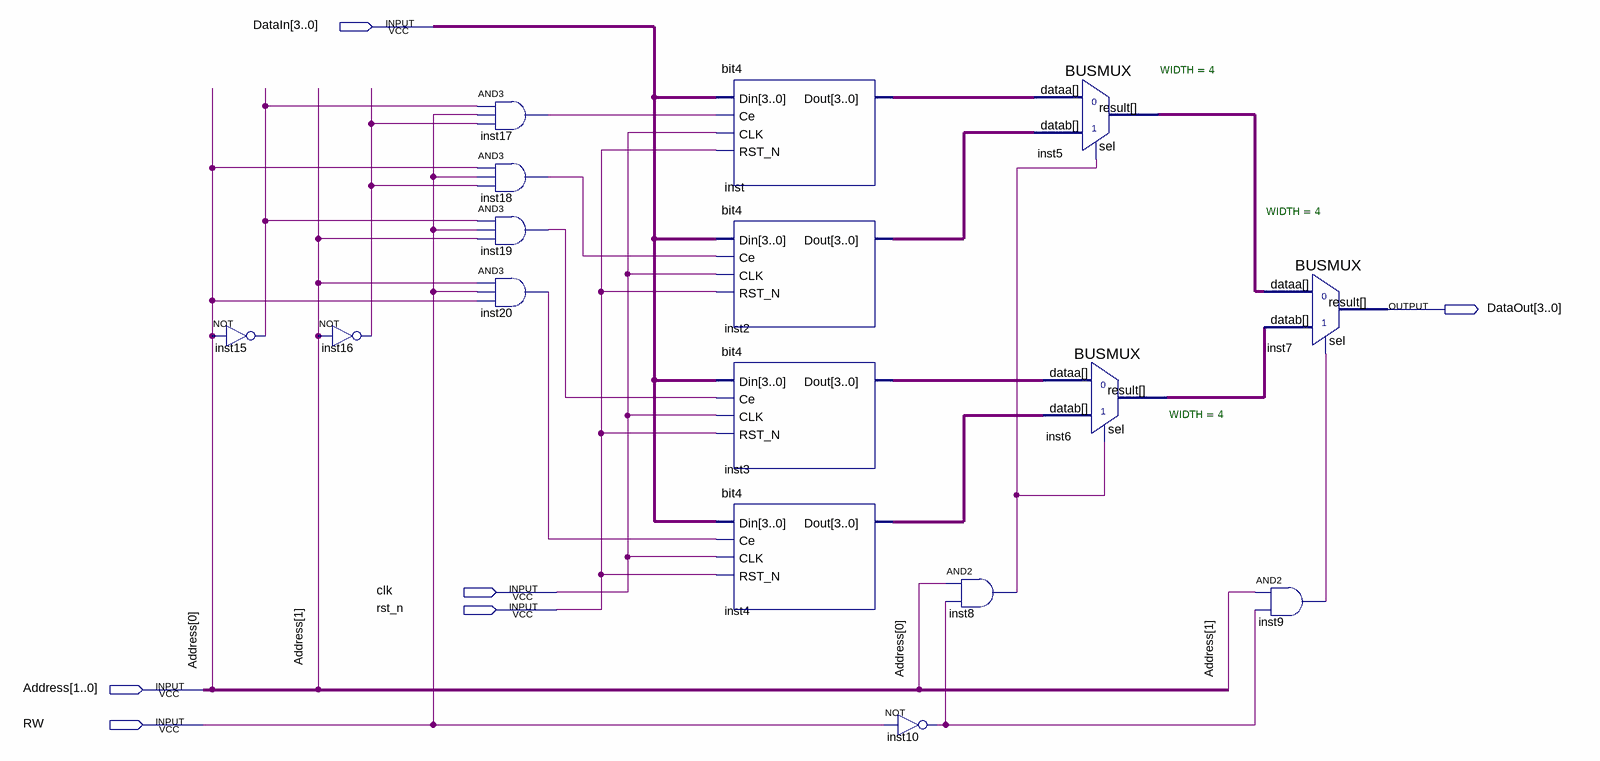
[diagram p0: schematic sheet]
// Quartus schematic chap5_1_chae.bdf as structural Verilog: 16 symbols, 6 pins
module chap5_1_chae (
  input  [3:0] DataIn,
  input  clk,
  input  rst_n,
  input  [1:0] Address,
  input  RW,
  output [3:0] DataOut
);

  wire inst8_out, inst9_out, inst10_out, inst15_out, inst16_out, inst17_out, inst18_out, inst19_out,
       inst20_out;
  wire [3:0] inst2_dout, inst3_dout, inst4_dout, inst5_result, inst6_result, inst_dout;

  not inst15 (inst15_out, Address[0]);
  not inst16 (inst16_out, Address[1]);
  and inst17 (inst17_out, inst15_out, RW, inst16_out);
  and inst18 (inst18_out, Address[0], RW, inst16_out);
  and inst19 (inst19_out, inst15_out, RW, Address[1]);
  and inst20 (inst20_out, Address[1], RW, Address[0]);
  bit4 inst (.Din(DataIn), .Ce(inst17_out), .CLK(clk), .RST_N(rst_n), .Dout(inst_dout));
  bit4 inst2 (.Din(DataIn), .Ce(inst18_out), .CLK(clk), .RST_N(rst_n), .Dout(inst2_dout));
  bit4 inst3 (.Din(DataIn), .Ce(inst19_out), .CLK(clk), .RST_N(rst_n), .Dout(inst3_dout));
  bit4 inst4 (.Din(DataIn), .Ce(inst20_out), .CLK(clk), .RST_N(rst_n), .Dout(inst4_dout));
  not inst10 (inst10_out, RW);
  and inst8 (inst8_out, Address[0], inst10_out);
  BUSMUX #(.WIDTH(4)) inst5 (.datab(inst2_dout), .sel(inst8_out), .dataa(inst_dout), .result(inst5_result));
  BUSMUX #(.WIDTH(4)) inst6 (.datab(inst4_dout), .sel(inst8_out), .dataa(inst3_dout), .result(inst6_result));
  BUSMUX #(.WIDTH(4)) inst7 (.datab(inst6_result), .sel(inst9_out), .dataa(inst5_result), .result(DataOut));
  and inst9 (inst9_out, Address[1], inst10_out);
endmodule
